# EAGLE design ProgramCounter (EAGLE 9.6.2)
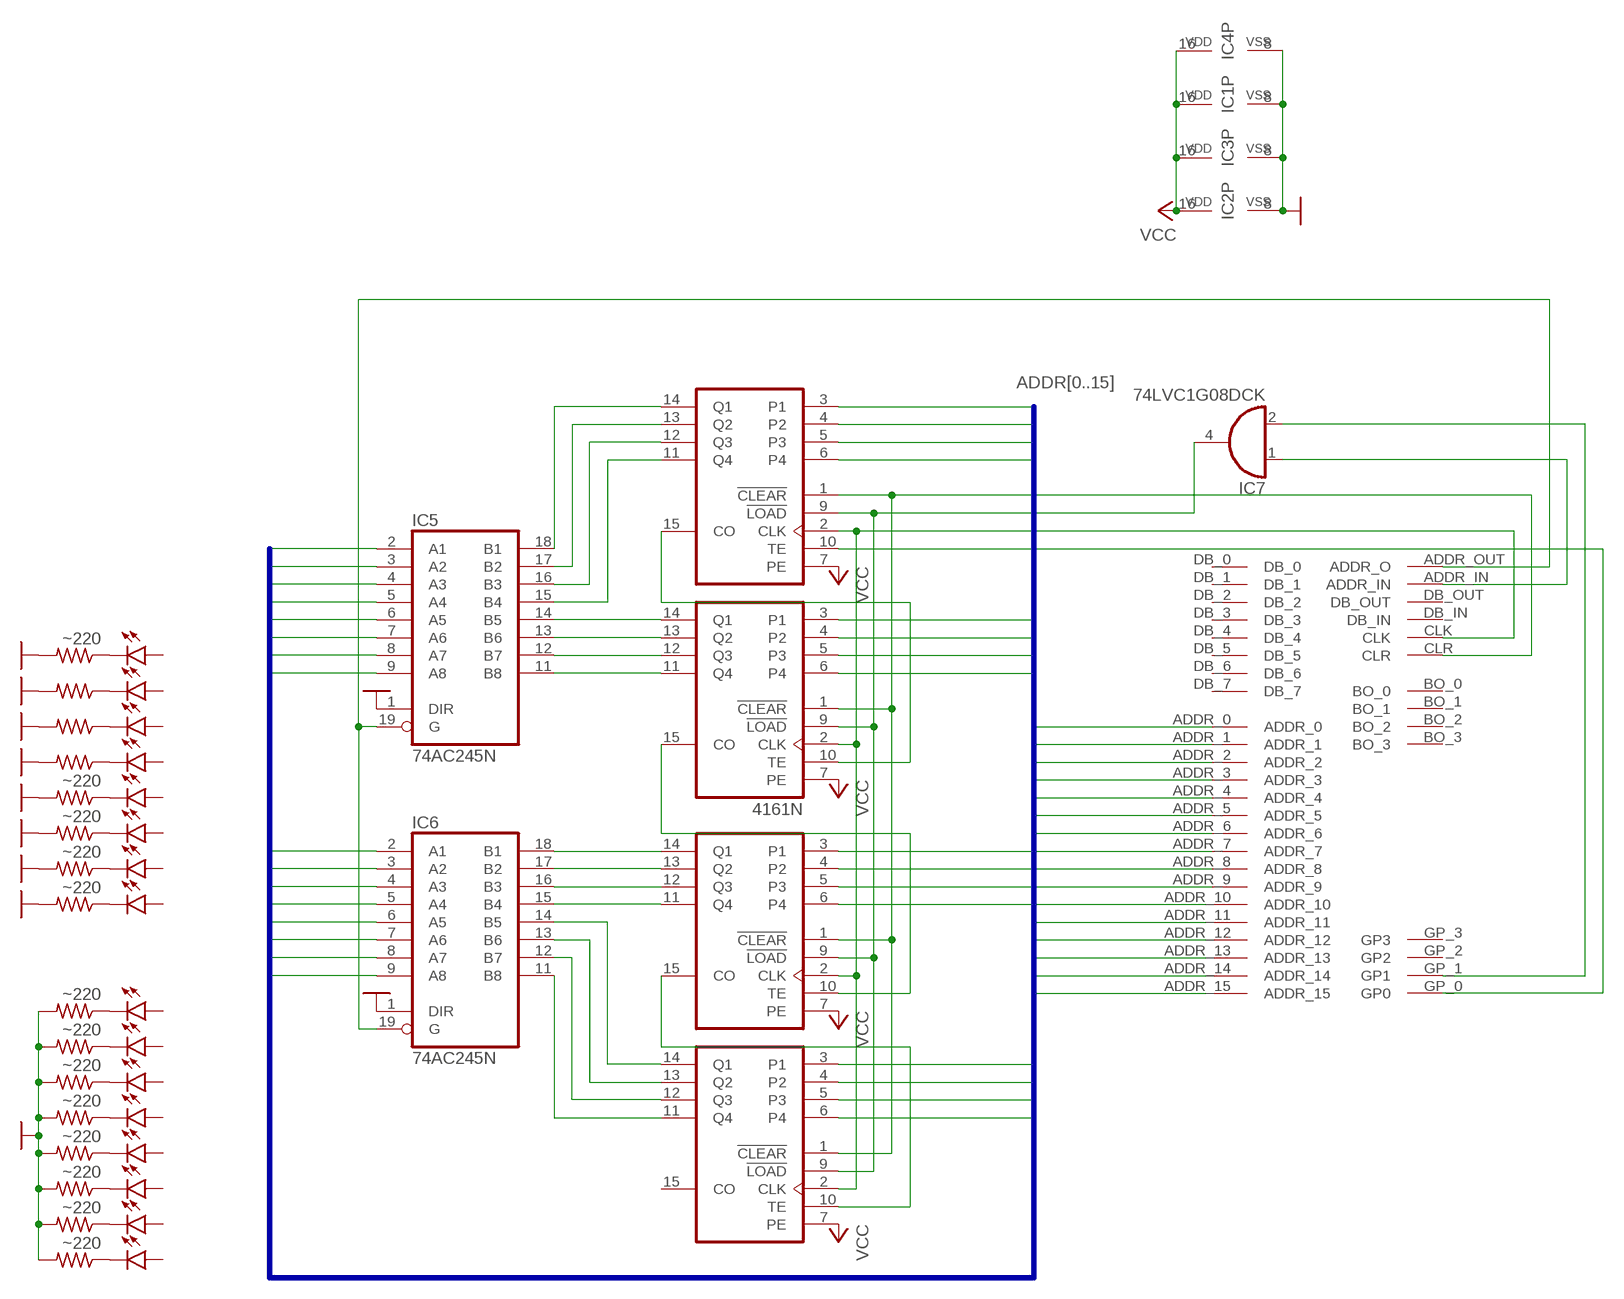
[diagram p0: schematic, sheet 1]

## Parts
IC1  4161N  [DIL16]
IC2  4161N  [DIL16]
IC3  4161N  [DIL16]
IC4  4161N  [DIL16]
IC5  74AC245N  [DIL20]
IC6  74AC245N  [DIL20]
IC7  74LVC1G08DCK  [SC70-5]
LED_A_REG_1  LED  LED5MM  [LED5MM]
LED_A_REG_2  LED  LED5MM  [LED5MM]
LED_A_REG_3  LED  LED5MM  [LED5MM]
LED_A_REG_4  LED  LED5MM  [LED5MM]
LED_A_REG_5  LED  LED5MM  [LED5MM]
LED_A_REG_6  LED  LED5MM  [LED5MM]
LED_A_REG_7  LED  LED5MM  [LED5MM]
LED_A_REG_8  LED  LED5MM  [LED5MM]
LED_A_REG_9  LED  LED5MM  [LED5MM]
LED_A_REG_10  LED  LED5MM  [LED5MM]
LED_A_REG_11  LED  LED5MM  [LED5MM]
LED_A_REG_12  LED  LED5MM  [LED5MM]
LED_A_REG_13  LED  LED5MM  [LED5MM]
LED_A_REG_14  LED  LED5MM  [LED5MM]
LED_A_REG_15  LED  LED5MM  [LED5MM]
LED_A_REG_16  LED  LED5MM  [LED5MM]
R1  ~220  R-US_0204/7  [0204/7]
R2  ~220  R-US_0204/7  [0204/7]
R3  ~220  R-US_0204/7  [0204/7]
R4  ~220  R-US_0204/7  [0204/7]
R5  ~220  R-US_0204/7  [0204/7]
R6  ~220  R-US_0204/7  [0204/7]
R7  ~220  R-US_0204/7  [0204/7]
R8  ~220  R-US_0204/7  [0204/7]
R9  ~220  R-US_0204/7  [0204/7]
R10  ~220  R-US_0204/7  [0204/7]
R11  ~220  R-US_0204/7  [0204/7]
R12  ~220  R-US_0204/7  [0204/7]
R13  ~220  R-US_0204/7  [0204/7]
R14  ~220  R-US_0204/7  [0204/7]
R15  ~220  R-US_0204/7  [0204/7]
R16  ~220  R-US_0204/7  [0204/7]
U$1  BACKPLATE_INTERFACEEDGE_FINGER  [BACK_INTERFACE-FOOT]

## Nets
ADDR0: IC2.3(P1) IC5.2(A1) U$1.ADDR_0
ADDR1: IC2.4(P2) IC5.3(A2) U$1.ADDR_1
ADDR2: IC2.5(P3) IC5.4(A3) U$1.ADDR_2
ADDR3: IC2.6(P4) IC5.5(A4) U$1.ADDR_3
ADDR4: IC3.3(P1) IC5.6(A5) U$1.ADDR_4
ADDR5: IC3.4(P2) IC5.7(A6) U$1.ADDR_5
ADDR6: IC3.5(P3) IC5.8(A7) U$1.ADDR_6
ADDR7: IC3.6(P4) IC5.9(A8) U$1.ADDR_7
ADDR8: IC1.3(P1) IC6.2(A1) U$1.ADDR_8
ADDR9: IC1.4(P2) IC6.3(A2) U$1.ADDR_9
ADDR10: IC1.5(P3) IC6.4(A3) U$1.ADDR_10
ADDR11: IC1.6(P4) IC6.5(A4) U$1.ADDR_11
ADDR12: IC4.3(P1) IC6.6(A5) U$1.ADDR_12
ADDR13: IC4.4(P2) IC6.7(A6) U$1.ADDR_13
ADDR14: IC4.5(P3) IC6.8(A7) U$1.ADDR_14
ADDR15: IC4.6(P4) IC6.9(A8) U$1.ADDR_15
CONFIRMED_LOAD: IC1.9(!LOAD) IC2.9(!LOAD) IC3.9(!LOAD) IC4.9(!LOAD) IC7.4(O)
GND: IC1.8(VSS) IC2.8(VSS) IC3.8(VSS) IC4.8(VSS) IC5.1(DIR) IC6.1(DIR) R1.2 R2.2 R3.2 R4.2 R5.2 R6.2 R7.2 R8.2 R9.2 R10.2 R11.2 R12.2 R13.2 R14.2 R15.2 R16.2
LOAD_CONFIRMATION: IC7.2(I1) U$1.GP_1(GP1)
LOAD_REQUEST: IC7.1(I0) U$1.ADDR_IN
N$1: IC2.14(Q1) IC5.18(B1)
N$2: IC2.13(Q2) IC5.17(B2)
N$3: IC2.12(Q3) IC5.16(B3)
N$4: IC2.11(Q4) IC5.15(B4)
N$5: IC1.14(Q1) IC6.18(B1)
N$6: IC3.13(Q2) IC5.13(B6)
N$7: IC3.12(Q3) IC5.12(B7)
N$8: IC3.11(Q4) IC5.11(B8)
N$9: IC1.13(Q2) IC6.17(B2)
N$10: IC1.12(Q3) IC6.16(B3)
N$11: IC1.11(Q4) IC6.15(B4)
N$12: IC4.11(Q4) IC6.11(B8)
N$13: IC4.12(Q3) IC6.12(B7)
N$14: IC4.13(Q2) IC6.13(B6)
N$15: IC4.14(Q1) IC6.14(B5)
N$17: IC1.2(CLK) IC2.2(CLK) IC3.2(CLK) IC4.2(CLK) U$1.CLK
N$19: IC1.1(!CLEAR) IC2.1(!CLEAR) IC3.1(!CLEAR) IC4.1(!CLEAR) U$1.CLR
N$20: IC2.15(CO) IC3.10(TE)
N$21: IC1.10(TE) IC3.15(CO)
N$22: IC1.15(CO) IC4.10(TE)
N$23: IC2.10(TE) U$1.GP_0(GP0)
N$24: IC5.19(G) IC6.19(G) U$1.ADDR_OUT(ADDR_O)
N$25: LED_A_REG_1.K(C) R1.1
N$26: LED_A_REG_10.K(C) R9.1
N$27: LED_A_REG_11.K(C) R10.1
N$28: LED_A_REG_12.K(C) R11.1
N$29: LED_A_REG_13.K(C) R12.1
N$30: LED_A_REG_14.K(C) R13.1
N$31: LED_A_REG_15.K(C) R14.1
N$32: LED_A_REG_16.K(C) R15.1
N$33: LED_A_REG_9.K(C) R16.1
N$34: IC3.14(Q1) IC5.14(B5)
N$120: LED_A_REG_2.K(C) R2.1
N$121: LED_A_REG_3.K(C) R3.1
N$122: LED_A_REG_4.K(C) R4.1
N$123: LED_A_REG_5.K(C) R5.1
N$124: LED_A_REG_6.K(C) R6.1
N$169: LED_A_REG_7.K(C) R7.1
N$176: LED_A_REG_8.K(C) R8.1
VCC: IC1.7(PE) IC1.16(VDD) IC2.7(PE) IC2.16(VDD) IC3.7(PE) IC3.16(VDD) IC4.7(PE) IC4.16(VDD)
Unconnected: IC4.15(CO) LED_A_REG_1.A LED_A_REG_2.A LED_A_REG_3.A LED_A_REG_4.A LED_A_REG_5.A LED_A_REG_6.A LED_A_REG_7.A LED_A_REG_8.A LED_A_REG_9.A LED_A_REG_10.A LED_A_REG_11.A LED_A_REG_12.A LED_A_REG_13.A LED_A_REG_14.A LED_A_REG_15.A LED_A_REG_16.A U$1.BO_0 U$1.BO_1 U$1.BO_2 U$1.BO_3 U$1.DB_0 U$1.DB_1 U$1.DB_2 U$1.DB_3 U$1.DB_4 U$1.DB_5 U$1.DB_6 U$1.DB_7 U$1.DB_IN U$1.DB_OUT U$1.GP_2(GP2) U$1.GP_3(GP3) U$1.NC_0 U$1.NC_1 U$1.NC_2 U$1.NC_3 U$1.NC_4 U$1.NC_5 U$1.NC_6 U$1.NC_7 U$1.NC_8 U$1.NC_9 U$1.NC_10 U$1.NC_11 U$1.NC_12 U$1.NC_13 U$1.NC_14 U$1.NC_15 U$1.NC_16 U$1.NC_17 U$1.NC_18 U$1.NC_19 U$1.NC_20 U$1.NC_21

## Buses
ADDR[0..15]

## Power pins joined to a net without a drawn wire
GND: IC5.10(GND) IC6.10(GND) IC7.3(GND) U$1.GND_0(GND) U$1.GND_1(GND)
VCC: IC5.20(VCC) IC6.20(VCC) IC7.5(VCC) U$1.VCC_0(VCC) U$1.VCC_1(VCC)

## Library data of the parts
IC1-IC4 = 40xx:4161: Synchronous presettable 4-bit binary COUNTER
IC5 IC6 = 74xx-eu:74*245: Octal BUS TRANSCEIVER, 3-state
IC7 = 74xx-little-de:74*1G08: 2-input AND gate
LED_A_REG_1-LED_A_REG_16 = led:LED: LED OSRAM: - CHIPLED LG R971, LG N971, LY N971, LG Q971, LY Q971, LO R971, LY R971 LH N974, LH R974 LS Q976, LO Q976, LY Q976 LO Q996 - Hyper CHIPLED LW Q18S LB Q993, LB Q99A, LB R99A - SideLED LS A670, LO A670, LY A670, LG A670, LP A670 LB A673, LV A673, LT A673, LW A673 LH A674 LY A675 LS A676, LA A676, LO A676, LY A676, LW A676 LS A679, LY A679, LG A679 - Hyper Micro SIDELED® LS Y876, LA Y876, LO Y876, LY Y876 LT Y87S - SmartLED LW L88C, LW L88S LB L89C, LB L89S, LG L890 LS L89K, LO L89K, LY L89K LS L896, LA L896, LO L896, LY L896 - TOPLED LS T670, LO T670, LY T670, LG T670, LP T670 LSG T670, LSP T670, LSY T670, LOP T670, LYG T670 LG T671, LOG T671, LSG T671 LB T673, LV T673, LT T673, LW T673 LH T674 LS T676, LA T676, LO T676, LY T676, LB T676, LH T676, LSB T676, LW T676 LB T67C, LV T67C, LT T67C, LS T67K, LO T67K, LY T67K, LW E67C LS E67B, LA E67B, LO E67B, LY E67B, LB E67C, LV E67C, LT E67C LW T67C LS T679, LY T679, LG T679 LS T770, LO T770, LY T770, LG T770, LP T770 LB T773, LV T773, LT T773, LW T773 LH T774 LS E675, LA E675, LY E675, LS T675 LS T776, LA T776, LO T776, LY T776, LB T776 LHGB T686 LT T68C, LB T68C - Hyper Mini TOPLED® LB M676 - Mini TOPLED Santana® LG M470 LS M47K, LO M47K, LY M47K Source: http://www.osram.convergy.de LUXEON: - LUMILED® LXK2-PW12-R00, LXK2-PW12-S00, LXK2-PW14-U00, LXK2-PW14-V00 LXK2-PM12-R00, LXK2-PM12-S00, LXK2-PM14-U00 LXK2-PE12-Q00, LXK2-PE12-R00, LXK2-PE12-S00, LXK2-PE14-T00, LXK2-PE14-U00 LXK2-PB12-K00, LXK2-PB12-L00, LXK2-PB12-M00, LXK2-PB14-N00, LXK2-PB14-P00, LXK2-PB14-Q00 LXK2-PR12-L00, LXK2-PR12-M00, LXK2-PR14-Q00, LXK2-PR14-R00 LXK2-PD12-Q00, LXK2-PD12-R00, LXK2-PD12-S00 LXK2-PH12-R00, LXK2-PH12-S00 LXK2-PL12-P00, LXK2-PL12-Q00, LXK2-PL12-R00 Source: www.luxeon.com KINGBRIGHT: KA-3528ASYC Source: www.kingbright.com
R1-R16 = rcl:R-US_: RESISTOR, American symbol; SPICEPREFIX: R
U$1 = Computer:BACKPLATE_INTERFACE

## Board
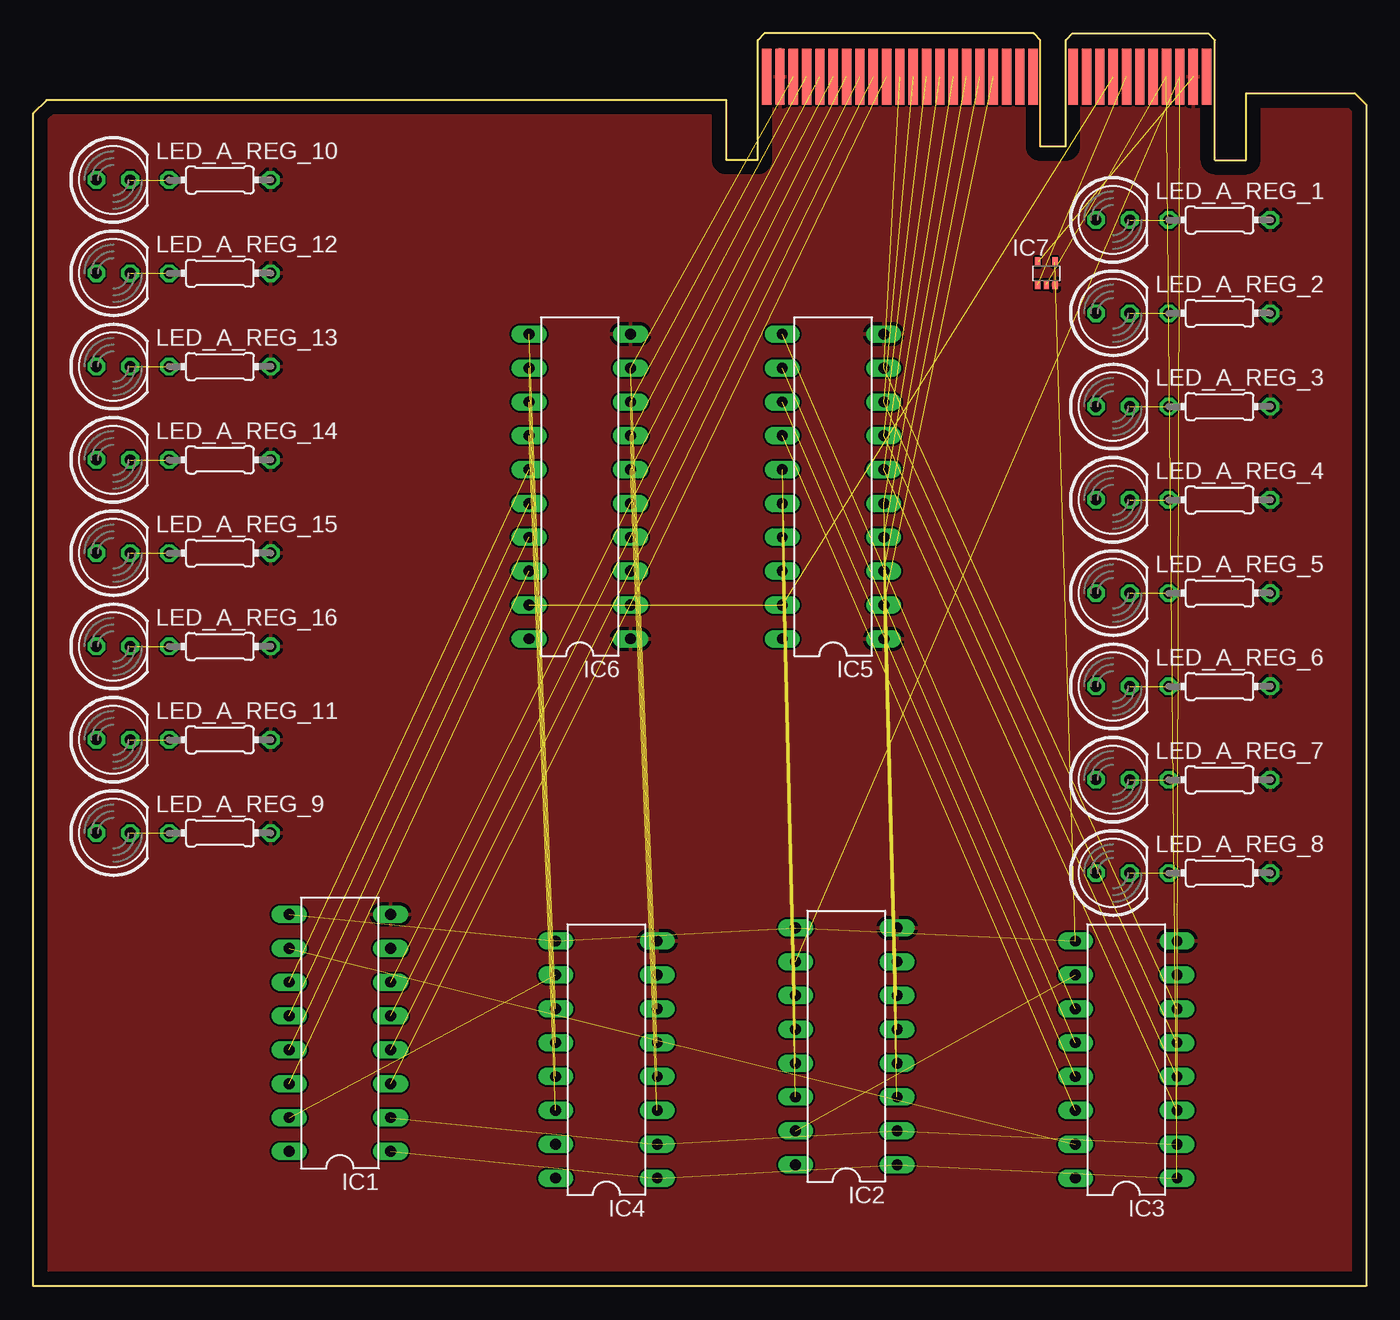
[diagram p1: board, top side]
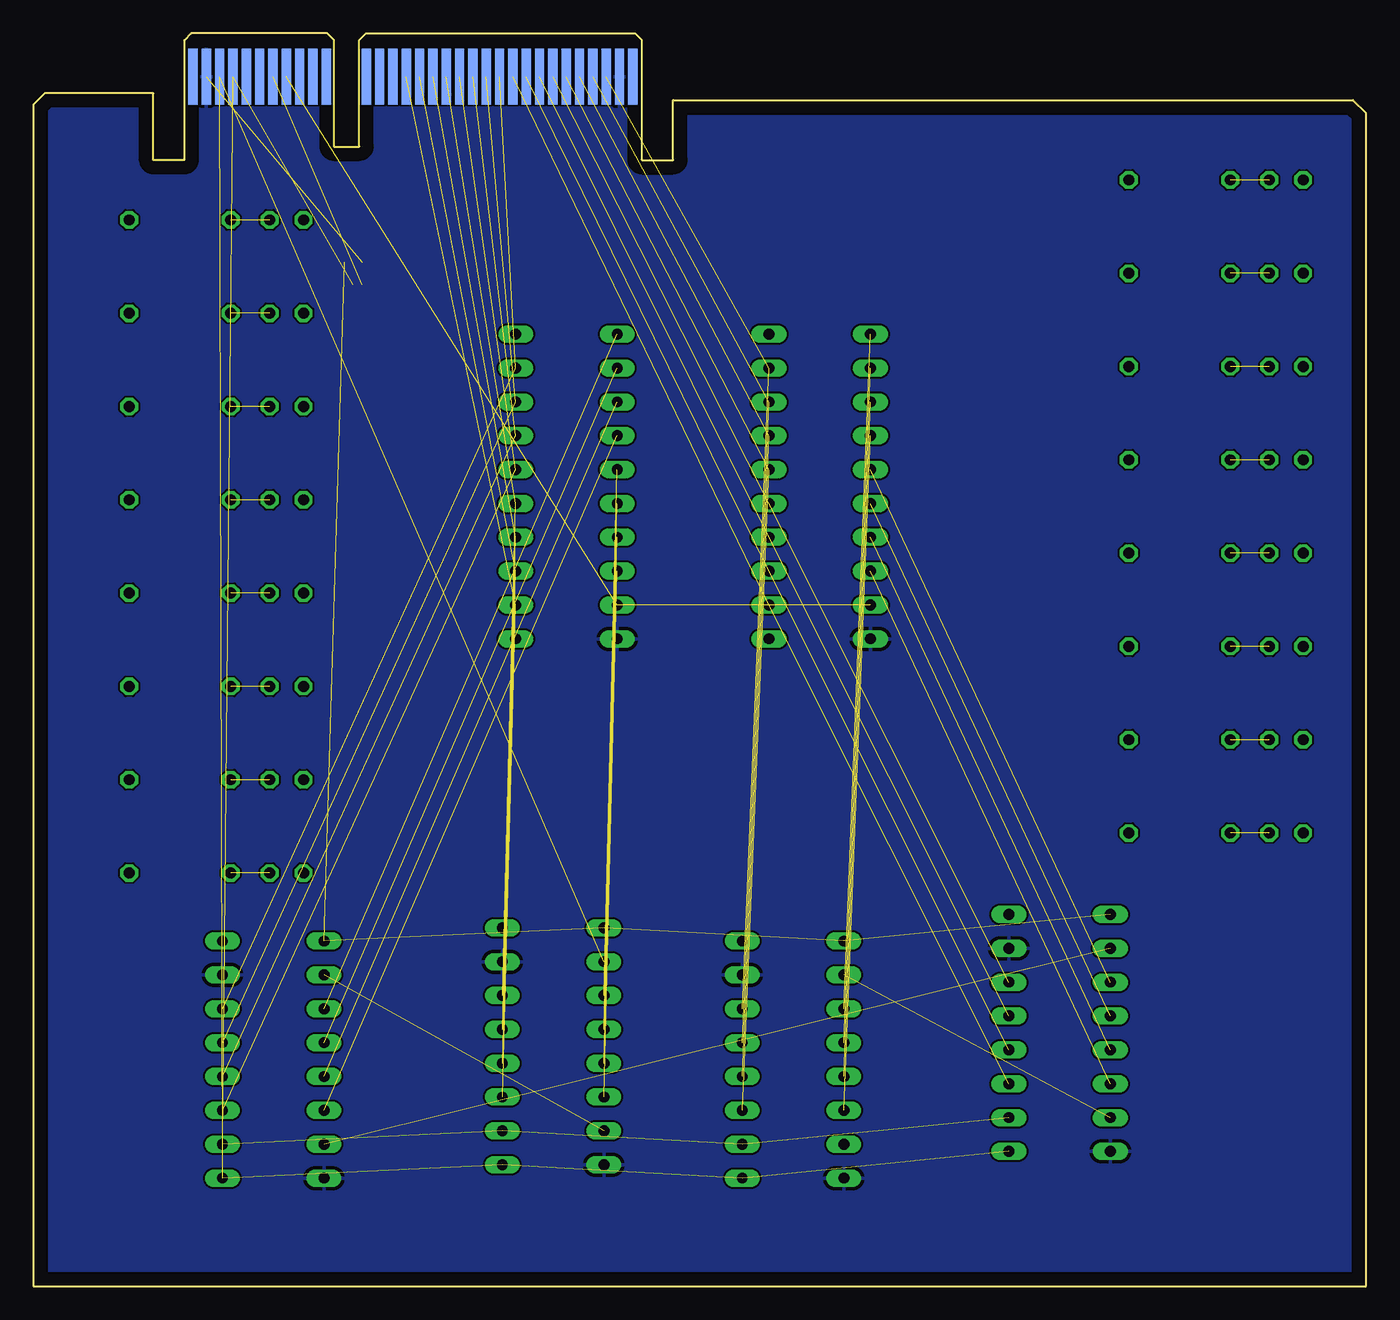
[diagram p2: board, bottom side, seen from below]

Size 100 x 94 mm. Coordinates in mm from the lower left corner, seen from the top.
Outline: 0,0 0,88 1,89 52,89 52,84.5 54.35,84.5 54.35,93.5 54.85,94 75.05,94 75.55,93.5 75.55,85.5 77.45,85.5 77.45,93.5 77.95,94 88.15,94 88.65,93.5 88.65,84.5 91,84.5 91,89.5 99.15,89.5 100,88.65 100,0 0,0
Copper layers (1*16): Top 0.035mm / dielectric 1.5mm / Bottom 0.035mm
Design rules "default *": minimum track width 6mil, minimum drill 0.35mm, track to track 6mil, track to pad 6mil, pad to pad 6mil, via to via 6mil, smd to smd 6mil, copper to edge 40mil, drill to drill 6mil, minimum pad ring 10mil, minimum via ring 8mil, stop-mask expansion 4mil, vias tented up to drill 0mil, thermal gap 10mil

### Footprints (pad centres in the part's own frame; a part is rotated, then mirrored left to right if it is on the bottom)
DIL16 = drill 0.813 long: 1 -8.89,-3.81; 2 -6.35,-3.81; 3 -3.81,-3.81; 4 -1.27,-3.81; 5 1.27,-3.81; 6 3.81,-3.81; 7 6.35,-3.81; 8 8.89,-3.81; 9 8.89,3.81; 10 6.35,3.81; 11 3.81,3.81; 12 1.27,3.81; 13 -1.27,3.81; 14 -3.81,3.81; 15 -6.35,3.81; 16 -8.89,3.81
DIL20 = drill 0.813 long: 1 -11.43,-3.81; 2 -8.89,-3.81; 3 -6.35,-3.81; 4 -3.81,-3.81; 5 -1.27,-3.81; 6 1.27,-3.81; 7 3.81,-3.81; 8 6.35,-3.81; 9 8.89,-3.81; 10 11.43,-3.81; 11 11.43,3.81; 12 8.89,3.81; 13 6.35,3.81; 14 3.81,3.81; 15 1.27,3.81; 16 -1.27,3.81; 17 -3.81,3.81; 18 -6.35,3.81; 19 -8.89,3.81; 20 -11.43,3.81
SC70-5 = smd 0.4 x 0.7: 1 -0.65,-0.85; 2 0,-0.85; 3 0.65,-0.85; 4 0.65,0.85; 5 -0.65,0.85
LED5MM = drill 0.813 octagon: A -1.27,0; K 1.27,0
0204/7 = drill 0.813 octagon: 1 -3.81,0; 2 3.81,0
BACK_INTERFACE-FOOT = smd 0.7 x 4.2: ADDR_0 17.02,0; ADDR_1 16.02,0; ADDR_2 15.02,0; ADDR_3 14.02,0; ADDR_4 13.02,0; ADDR_5 12.02,0; ADDR_6 11.02,0; ADDR_7 10.02,0; ADDR_8 9.02,0; ADDR_9 8.02,0; ADDR_10 7.02,0; ADDR_11 6.02,0; ADDR_12 5.02,0; ADDR_13 4.02,0; ADDR_14 3.02,0; ADDR_15 2.02,0; ADDR_IN 27.02,0; ADDR_OUT 26.02,0; CLK 30.02,0; CLR 31.02,0; DB_IN 29.02,0; DB_OUT 28.02,0; GND_0 32.02,0; GND_1 1.02,0; NC_0 33.02,0; NC_1 25.02,0; NC_2 24.02,0; NC_3 23.02,0; NC_4 20.02,0; NC_5 19.02,0; NC_6 18.02,0; NC_7 0.02,0 | smd 0.7 x 4.2 bottom: BO_0 27.02,0; BO_1 26.02,0; BO_2 25.02,0; BO_3 24.02,0; DB_0 18.02,0; DB_1 17.02,0; DB_2 16.02,0; DB_3 15.02,0; DB_4 14.02,0; DB_5 13.02,0; DB_6 12.02,0; DB_7 11.02,0; GP_0 31.02,0; GP_1 30.02,0; GP_2 29.02,0; GP_3 28.02,0; NC_8 33.02,0; NC_9 23.02,0; NC_10 20.02,0; NC_11 19.02,0; NC_12 10.02,0; NC_13 9.02,0; NC_14 8.02,0; NC_15 7.02,0; NC_16 6.02,0; NC_17 5.02,0; NC_18 4.02,0; NC_19 3.02,0; NC_20 2.02,0; NC_21 0.02,0; VCC_0 32.02,0; VCC_1 1.02,0

### Placement (x,y rotation side)
IC1  23,19 90 top
IC2  61,18 90 top
IC3  82,17 90 top
IC4  43,17 90 top
IC5  60,60 90 top
IC6  41,60 90 top
IC7  76,76 0 top
LED_A_REG_1  81,80 0 top
LED_A_REG_2  81,73 0 top
LED_A_REG_3  81,66 0 top
LED_A_REG_4  81,59 0 top
LED_A_REG_5  81,52 0 top
LED_A_REG_6  81,45 0 top
LED_A_REG_7  81,38 0 top
LED_A_REG_8  81,31 0 top
LED_A_REG_9  6,34 0 top
LED_A_REG_10  6,83 0 top
LED_A_REG_11  6,41 0 top
LED_A_REG_12  6,76 0 top
LED_A_REG_13  6,69 0 top
LED_A_REG_14  6,62 0 top
LED_A_REG_15  6,55 0 top
LED_A_REG_16  6,48 0 top
R1  89,80 0 top
R2  89,73 0 top
R3  89,66 0 top
R4  89,59 0 top
R5  89,52 0 top
R6  89,45 0 top
R7  89,38 0 top
R8  89,31 0 top
R9  14,83 0 top
R10  14,41 0 top
R11  14,76 0 top
R12  14,69 0 top
R13  14,62 0 top
R14  14,55 0 top
R15  14,48 0 top
R16  14,34 0 top
U$1  55,90.75 0 top

### Tracks (layer width: path | path; a pad name or v marks a point on that pad's centre or on a via)
ADDR0  (2 unrouted)
ADDR1  (2 unrouted)
ADDR2  (2 unrouted)
ADDR3  (2 unrouted)
ADDR4  (2 unrouted)
ADDR5  (2 unrouted)
ADDR6  (2 unrouted)
ADDR7  (2 unrouted)
ADDR8  (2 unrouted)
ADDR9  (2 unrouted)
ADDR10  (2 unrouted)
ADDR11  (2 unrouted)
ADDR12  (2 unrouted)
ADDR13  (2 unrouted)
ADDR14  (2 unrouted)
ADDR15  (2 unrouted)
CONFIRMED_LOAD  (4 unrouted)
GND
  pour Top: 0,88 1,89 52,89 52,84.5 54.35,84.5 54.35,93.5 54.85,94 75.05,94 75.55,93.5 75.55,85.5 77.45,85.5 77.45,93.5 77.95,94 88.15,94 88.65,93.5 88.65,84.5 91,84.5 91,89.5 99.15,89.5 100,88.65 100,0 0,0
LOAD_CONFIRMATION  (1 unrouted)
LOAD_REQUEST  (1 unrouted)
N$1  (1 unrouted)
N$2  (1 unrouted)
N$3  (1 unrouted)
N$4  (1 unrouted)
N$5  (1 unrouted)
N$6  (1 unrouted)
N$7  (1 unrouted)
N$8  (1 unrouted)
N$9  (1 unrouted)
N$10  (1 unrouted)
N$11  (1 unrouted)
N$12  (1 unrouted)
N$13  (1 unrouted)
N$14  (1 unrouted)
N$15  (1 unrouted)
N$17  (4 unrouted)
N$19  (4 unrouted)
N$20  (1 unrouted)
N$21  (1 unrouted)
N$22  (1 unrouted)
N$23  (1 unrouted)
N$24  (2 unrouted)
N$25  (1 unrouted)
N$26  (1 unrouted)
N$27  (1 unrouted)
N$28  (1 unrouted)
N$29  (1 unrouted)
N$30  (1 unrouted)
N$31  (1 unrouted)
N$32  (1 unrouted)
N$33  (1 unrouted)
N$34  (1 unrouted)
N$120  (1 unrouted)
N$121  (1 unrouted)
N$122  (1 unrouted)
N$123  (1 unrouted)
N$124  (1 unrouted)
N$169  (1 unrouted)
N$176  (1 unrouted)
VCC  (1 unrouted)
  pour Bottom: 0,88 1,89 52,89 52,84.5 54.35,84.5 54.35,93.5 54.85,94 75.05,94 75.55,93.5 75.55,85.5 77.45,85.5 77.45,93.5 77.95,94 88.15,94 88.65,93.5 88.65,84.5 91,84.5 91,89.5 99.15,89.5 100,88.65 100,-1 0,-1